# EAGLE design EngineLightControl_v1.1 (EAGLE 9.6.0)
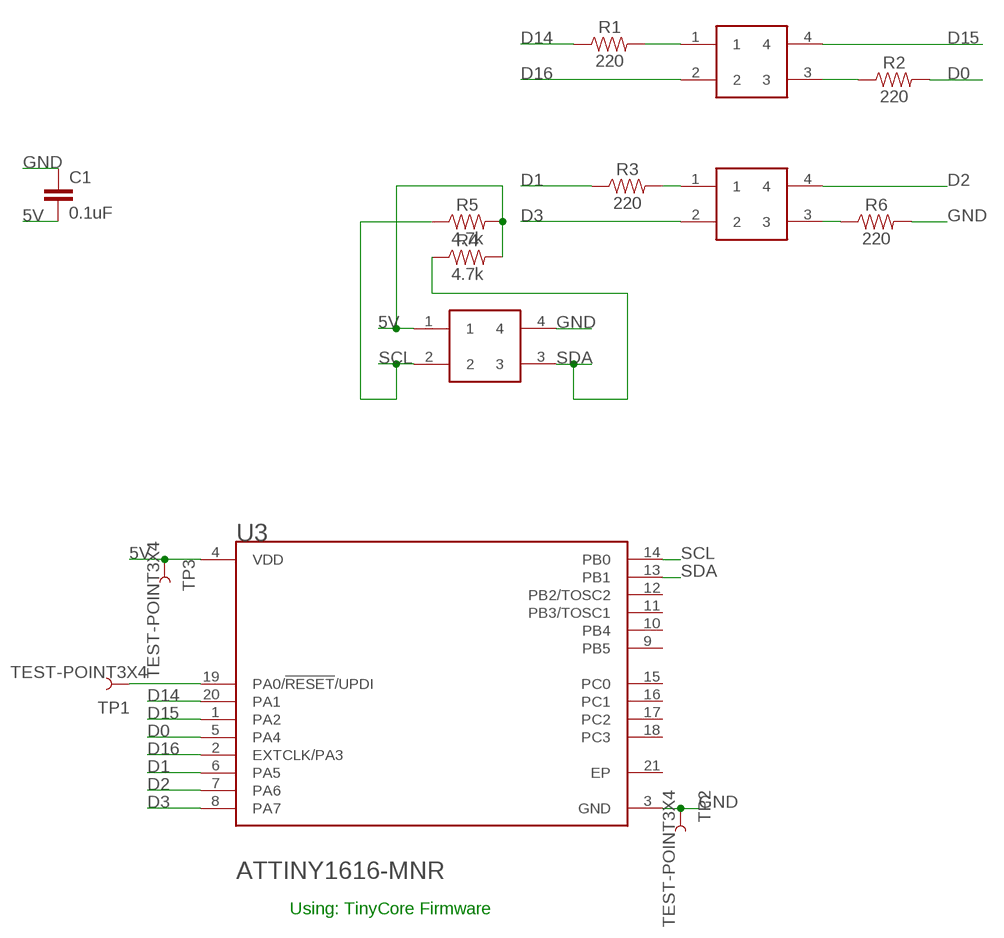
[diagram p0: schematic, sheet 1]

## Parts
C1  0.1uF  0.1UF-0603-25V-(+80/-20%)  [0603]
R1  220  220OHM-0603-1/10W-1%  [0603]
R2  220  220OHM-0603-1/10W-1%  [0603]
R3  220  220OHM-0603-1/10W-1%  [0603]
R4  4.7k  4.7KOHM-0603-1/10W-1%  [0603]
R5  4.7k  4.7KOHM-0603-1/10W-1%  [0603]
R6  220  220OHM-0603-1/10W-1%  [0603]
TP1  TEST-POINT3X4  [PAD.03X.04]
TP2  TEST-POINT3X4  [PAD.03X.04]
TP3  TEST-POINT3X4  [PAD.03X.04]
U3  MICROCHIP_ATTINY1616-MNRMICROCHIP_ATTINY1616-MNR_0_0  [MICROCHIP_ATTINY1616-MNR_0]
U$1  CONN_M04  [CONN_04]
U$2  CONN_M04  [CONN_04]
U$3  CONN_M04  [CONN_04]

## Nets
5V: C1.2 R4.2 R5.2 TP3.P$1 U3.4(VDD) U$1.1
D0: R2.2 U3.5(PA4)
D0_OUT: R2.1 U$2.3
D1: R3.1 U3.6(PA5)
D1_OUT: R3.2 U$3.1
D2: U3.7(PA6) U$3.4
D2_KATH: R6.1 U$3.3
D3: U3.8(PA7) U$3.2
D14: R1.1 U3.20(PA1)
D14_OUT: R1.2 U$2.1
D15: U3.1(PA2) U$2.4
D16: U3.2(EXTCLK/PA3) U$2.2
GND: C1.1 R6.2 TP2.P$1 U3.3(GND) U$1.4
SCL: R5.1 U3.14(PB0) U$1.2
SDA: R4.1 U3.13(PB1) U$1.3
UPDI: TP1.P$1 U3.19(PA0/!RESET!/UPDI)
Unconnected: U3.9(PB5) U3.10(PB4) U3.11(PB3/TOSC1) U3.12(PB2/TOSC2) U3.15(PC0) U3.16(PC1) U3.17(PC2) U3.18(PC3)

## Notes on the sheet
- Using: TinyCore Firmware

## Power pins joined to a net without a drawn wire
EP: U3.21(EP)

## Library data of the parts
C1 = SparkFun-Capacitors:0.1UF: 0.1µF ceramic capacitors A capacitor is a passive two-terminal electrical component used to store electrical energy temporarily in an electric field.; PROD_ID: CAP-00810
R1-R3 R6 = SparkFun-Resistors:220OHM: 220Ω resistor A resistor is a passive two-terminal electrical component that implements electrical resistance as a circuit element. Resistors act to reduce current flow, and, at the same time, act to lower voltage levels within circuits. - Wikipedia; PROD_ID: RES-07861
R4 R5 = SparkFun-Resistors:4.7KOHM: 4.7kΩ resistor A resistor is a passive two-terminal electrical component that implements electrical resistance as a circuit element. Resistors act to reduce current flow, and, at the same time, act to lower voltage levels within circuits. - Wikipedia; PROD_ID: RES-07857
TP1-TP3 = SparkFun-Connectors:TEST-POINT: SparkFun Test Points Bare copper test points for troubleshooting or In-Circuit-Testing. These are used by our Production team for verifying production board runs using pogo-pins on test beds. SparkFun Products: SparkFun LSM9DS1 Breakout <https://www.sparkfun.com/products/13284> SparkFun PSOC <https://www.sparkfun.com/products/13714> SparkFun Load Cell Amplifier <https://www.sparkfun.com/products/13879>
U3 = Microchip - ATTINY1616-MNR:MICROCHIP_ATTINY1616-MNR: AVR tinyAVR™ 1 Microcontroller IC 8-Bit 20MHz 16KB (16K x 8) FLASH 20-VQFN (3x3); AUTOMOTIVE: No; CENTROID_NOT_SPECIFIED: No; CORE_ARCHITECTURE: AVR; DATASHEET: http://ww1.microchip.com/downloads/en/DeviceDoc/ATtiny1616-3216-DataSheet-DS40001997C.pdf; DATA_BUS_WIDTH: 8bits; DEVICE_CLASS_L1: Integrated Circuits (ICs); DEVICE_CLASS_L2: Embedded Processors and Controllers; DEVICE_CLASS_L3: Microcontrollers; DIGIKEY_DESCRIPTION: IC MCU 8BIT 16KB FLASH 20VQFN; DIGIKEY_PART_NUMBER: ATTINY1616-MNRCT-ND; FOOTPRINT_PARAMETERS_1: {"fp_type":"QFN","params":{"N1":{"nom":5,"long name":"Leads on long side","min":null,"max":null,"short name":"N1","type":"count"},"N2":{"nom":5,"long name":"Leads on wide side","min":null,"max":null,"short name":"N2","type":"count"},"A":{"nom":850000,"long name":"Height","min":800000,"max":900000,"short name":"A","type":"measurement"},"A1":{"nom":35000,"long name":"Package clearance","min":0,"max":50000,"short name":"A1","type":"measurement"},"A2":{"nom":false,"long name":"Package height","min":750000,"max":900000,"short name":"A2","type":"measurement"},"D":{"nom":3000000,"long name":"Package length","min":2900000,"max":3100000,"short name":"D","type":"measurement"},"E":{"nom":3000000,"long name":"Package width","min":2900000,"max":3100000,"short name":"E","type":"measurement"},"B":{"nom":200000,"long name":"Lead width","min":150000,"max":250000,"short name":"B","type":"measurement"},"C":{"nom":203000,"long name":"Lead thickness","min":null,"max":null,"short name":"C","type":"measurement"},"L":{"nom":400000,"long name":"Lead foot length","min":350000,"max":450000,"short name":"L","type":"measurement"},"e":{"nom":400000,"long name":"Lead pitch","min":null,"max":null,"short name":"e","type":"measurement"},"HT":{"default":"Yes","long name":"Thermal pad","type":"multichoiceparent","short name":"HT","children":["D2","E2","PC"]},"offset x":{"nom":0,"long name":"X Center offset","min":null,"max":null,"short name":"offset x","type":"measurement"},"offset y":{"nom":0,"long name":"Y Center offset","min":null,"max":null,"short name":"offset y","type":"measurement"},"LS":{"default":"Rounded rectangle","long name":"Land shape","type":"multichoice","short name":"LS"},"LS1":{"default":"Rectangle","long name":"Land shape (Pin 1)","type":"multichoice","short name":"LS1"},"solder toe":{"nom":400000,"long name":"Solder fillet (toe)","min":null,"max":null,"short name":"solder toe","type":"fixedmeasurement"},"solder heel":{"nom":0,"long name":"Solder fillet (heel)","min":null,"max":null,"short name":"solder heel","type":"fixedmeasurement"},"solder side":{"nom":-40000,"long name":"Solder fillet (side)","min":null,"max":null,"short name":"solder side","type":"fixedmeasurement"},"courtyard":{"nom":500000,"long name":"Courtyard","min":null,"max":null,"short name":"courtyard","type":"fixedmeasurement"},"SF":{"default":"A","long name":"Packing level","type":"multichoiceparent","short name":"SF","help":"http://support.upverter.com/customer/portal/articles/978783-what-is-a-footprint-packing-level","children":["solder toe","solder heel","solder side","courtyard"]},"D2":{"nom":1700000,"long name":"Thermal pad length","min":1600000,"max":1800000,"short name":"D2","type":"measurement"},"E2":{"nom":1700000,"long name":"Thermal pad width","min":1600000,"max":1800000,"short name":"E2","type":"measurement"},"PC":{"long name":"Paste coverage (%)","type":"percentage","short name":"PC","value":40}}}; FOOTPRINT_PARAMETERS_2: {"fp_type":"QFN","params":{"N1":{"nom":5,"long name":"Leads on long side","min":null,"max":null,"short name":"N1","type":"count"},"N2":{"nom":5,"long name":"Leads on wide side","min":null,"max":null,"short name":"N2","type":"count"},"A":{"nom":850000,"long name":"Height","min":800000,"max":900000,"short name":"A","type":"measurement"},"A1":{"nom":35000,"long name":"Package clearance","min":0,"max":50000,"short name":"A1","type":"measurement"},"A2":{"nom":false,"long name":"Package height","min":750000,"max":900000,"short name":"A2","type":"measurement"},"D":{"nom":3000000,"long name":"Package length","min":2900000,"max":3100000,"short name":"D","type":"measurement"},"E":{"nom":3000000,"long name":"Package width","min":2900000,"max":3100000,"short name":"E","type":"measurement"},"B":{"nom":200000,"long name":"Lead width","min":150000,"max":250000,"short name":"B","type":"measurement"},"C":{"nom":203000,"long name":"Lead thickness","min":null,"max":null,"short name":"C","type":"measurement"},"L":{"nom":400000,"long name":"Lead foot length","min":350000,"max":450000,"short name":"L","type":"measurement"},"e":{"nom":400000,"long name":"Lead pitch","min":null,"max":null,"short name":"e","type":"measurement"},"D2":{"nom":1700000,"long name":"Thermal pad length","min":1600000,"max":1800000,"short name":"D2","type":"measurement"},"E2":{"nom":1700000,"long name":"Thermal pad width","min":1600000,"max":1800000,"short name":"E2","type":"measurement"},"PC":{"long name":"Paste coverage (%)","type":"percentage","short name":"PC","value":40},"HT":{"default":"Yes","long name":"Thermal pad","type":"multichoiceparent","short name":"HT","children":["D2","E2","PC"]},"offset x":{"nom":0,"long name":"X Center offset","min":null,"max":null,"short name":"offset x","type":"measurement"},"offset y":{"nom":0,"long name":"Y Center offset","min":null,"max":null,"short name":"offset y","type":"measurement"},"LS":{"default":"Rounded rectangle","long name":"Land shape","type":"multichoice","short name":"LS"},"LS1":{"default":"Rectangle","long name":"Land shape (Pin 1)","type":"multichoice","short name":"LS1"},"solder toe":{"nom":300000,"long name":"Solder fillet (toe)","min":null,"max":null,"short name":"solder toe","type":"fixedmeasurement"},"solder heel":{"nom":0,"long name":"Solder fillet (heel)","min":null,"max":null,"short name":"solder heel","type":"fixedmeasurement"},"solder side":{"nom":-40000,"long name":"Solder fillet (side)","min":null,"max":null,"short name":"solder side","type":"fixedmeasurement"},"courtyard":{"nom":250000,"long name":"Courtyard","min":null,"max":null,"short name":"courtyard","type":"fixedmeasurement"},"SF":{"default":"B","long name":"Packing level","type":"multichoiceparent","short name":"SF","help":"http://support.upverter.com/customer/portal/articles/978783-what-is-a-footprint-packing-level","children":["solder toe","solder heel","solder side","courtyard"]}}}; FOOTPRINT_PARAMETERS_3: {"fp_type":"QFN","params":{"N1":{"nom":5,"long name":"Leads on long side","min":null,"max":null,"short name":"N1","type":"count"},"N2":{"nom":5,"long name":"Leads on wide side","min":null,"max":null,"short name":"N2","type":"count"},"A":{"nom":850000,"long name":"Height","min":800000,"max":900000,"short name":"A","type":"measurement"},"A1":{"nom":35000,"long name":"Package clearance","min":0,"max":50000,"short name":"A1","type":"measurement"},"A2":{"nom":false,"long name":"Package height","min":750000,"max":900000,"short name":"A2","type":"measurement"},"D":{"nom":3000000,"long name":"Package length","min":2900000,"max":3100000,"short name":"D","type":"measurement"},"E":{"nom":3000000,"long name":"Package width","min":2900000,"max":3100000,"short name":"E","type":"measurement"},"B":{"nom":200000,"long name":"Lead width","min":150000,"max":250000,"short name":"B","type":"measurement"},"C":{"nom":203000,"long name":"Lead thickness","min":null,"max":null,"short name":"C","type":"measurement"},"L":{"nom":400000,"long name":"Lead foot length","min":350000,"max":450000,"short name":"L","type":"measurement"},"e":{"nom":400000,"long name":"Lead pitch","min":null,"max":null,"short name":"e","type":"measurement"},"D2":{"nom":1700000,"long name":"Thermal pad length","min":1600000,"max":1800000,"short name":"D2","type":"measurement"},"E2":{"nom":1700000,"long name":"Thermal pad width","min":1600000,"max":1800000,"short name":"E2","type":"measurement"},"PC":{"long name":"Paste coverage (%)","type":"percentage","short name":"PC","value":40},"HT":{"default":"Yes","long name":"Thermal pad","type":"multichoiceparent","short name":"HT","children":["D2","E2","PC"]},"offset x":{"nom":0,"long name":"X Center offset","min":null,"max":null,"short name":"offset x","type":"measurement"},"offset y":{"nom":0,"long name":"Y Center offset","min":null,"max":null,"short name":"offset y","type":"measurement"},"LS":{"default":"Rounded rectangle","long name":"Land shape","type":"multichoice","short name":"LS"},"LS1":{"default":"Rectangle","long name":"Land shape (Pin 1)","type":"multichoice","short name":"LS1"},"solder toe":{"nom":200000,"long name":"Solder fillet (toe)","min":null,"max":null,"short name":"solder toe","type":"fixedmeasurement"},"solder heel":{"nom":0,"long name":"Solder fillet (heel)","min":null,"max":null,"short name":"solder heel","type":"fixedmeasurement"},"solder side":{"nom":-40000,"long name":"Solder fillet (side)","min":null,"max":null,"short name":"solder side","type":"fixedmeasurement"},"courtyard":{"nom":100000,"long name":"Courtyard","min":null,"max":null,"short name":"courtyard","type":"fixedmeasurement"},"SF":{"default":"C","long name":"Packing level","type":"multichoiceparent","short name":"SF","help":"http://support.upverter.com/customer/portal/articles/978783-what-is-a-footprint-packing-level","children":["solder toe","solder heel","solder side","courtyard"]}}}; FOOTPRINT_VARIANT_NAME_0: Recommended_Land_Pattern; FOOTPRINT_VARIANT_NAME_1: IPC_A; FOOTPRINT_VARIANT_NAME_2: IPC_B; FOOTPRINT_VARIANT_NAME_3: IPC_C; FREQUENCY: 20MHz; HEIGHT: 0.9mm; INTERFACE: I2C,SPI,UART,USART,2-Wire,LIN,IrDA,RS-485; IPC_LAND_PATTERN_NAME: QFN40P300X300X85-20; LEAD_FREE: Yes; MAX_SUPPLY_VOLTAGE: 5.5V; MEMORY_SIZE: 16KBytes; MEMORY_TYPE: FLASH; MF: Microchip; MFG_PACKAGE_IDENT: C04-21380; MFG_PACKAGE_IDENT_COMPONENT_ID: caf5ea648aae8d21; MFG_PACKAGE_IDENT_DATE: 0; MFG_PACKAGE_IDENT_REV: A; MIN_SUPPLY_VOLTAGE: 1.8V; MOUSER_DESCRIPTION: MCU 8-bit AVR RISC 16KB Flash 2.5V/3.3V/5V 20-Pin VQFN EP T/R; MOUSER_PART_NUMBER: 556-ATTINY1616MNR; MPN: ATTINY1616-MNR; NOMINAL_SUPPLY_CURRENT: 5-10200uA; NUMBER_OF_A/D_CONVERTERS: 2; NUMBER_OF_ADC_CHANNELS: 20; NUMBER_OF_CORES: 1; NUMBER_OF_I/OS: 18; NUMBER_OF_I2C_CHANNELS: 1; NUMBER_OF_SPI_CHANNELS: 1; NUMBER_OF_TIMERS/COUNTERS: 3; NUMBER_OF_UART_CHANNELS: 1; PACKAGE: VQFN20; PREFIX: U; RAM_SIZE: 2KBytes; ROHS: Yes; STANDOFF_HEIGHT: 0mm; TEMPERATURE_RANGE_HIGH: +105°C; TEMPERATURE_RANGE_LOW: -40°C; VERIFICATION_VERSION: 0.0.0.3
U$1-U$3 = jk_customs:CONN_M04

## Net classes
0 Default: width 0.203 mm

## Board
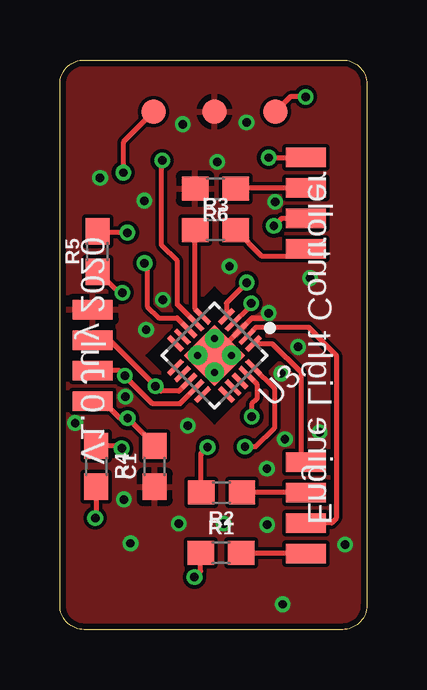
[diagram p1: board, top side]
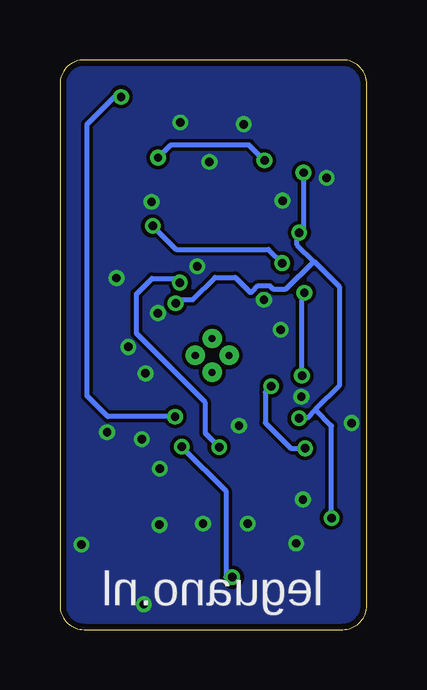
[diagram p2: board, bottom side, seen from below]

Size 12.8 x 23.75 mm. Coordinates in mm from the lower left corner, seen from the top.
Outline: 12.8,22.75 12.8,1 arc-90 11.8,0 1,0 arc-90 0,1 0,22.75 arc-90 1,23.75 11.8,23.75 arc-90 12.8,22.75
Copper layers (1*16): Top 0.035mm / dielectric 1.5mm / Bottom 0.035mm
Design rules "SeeedStudio_2layer_DRU_no_angle_20140221": minimum track width 6mil, minimum drill 12mil, track to track 6mil, track to pad 6mil, pad to pad 6mil, via to via 6mil, smd to smd 0mil, copper to edge 10mil, drill to drill 10mil, minimum pad ring 10mil, minimum via ring 6mil, stop-mask expansion 2mil, vias tented up to drill 100mil, thermal gap 10mil

### Footprints (pad centres in the part's own frame; a part is rotated, then mirrored left to right if it is on the bottom)
0603 = smd 1.1 x 1: 1 -0.85,0; 2 0.85,0
PAD.03X.04 = smd 1.016 x 1.016: P$1 0,0
MICROCHIP_ATTINY1616-MNR_0 = smd 0.8 x 0.2: 1 -1.5,0.8; 2 -1.5,0.4; 3 -1.5,0; 4 -1.5,-0.4; 5 -1.5,-0.8; 11 1.5,-0.8; 12 1.5,-0.4; 13 1.5,0; 14 1.5,0.4; 15 1.5,0.8 | smd 0.2 x 0.8: 6 -0.8,-1.5; 7 -0.4,-1.5; 8 0,-1.5; 9 0.4,-1.5; 10 0.8,-1.5; 16 0.8,1.5; 17 0.4,1.5; 18 0,1.5; 19 -0.4,1.5; 20 -0.8,1.5 | smd 1.8 x 1.8: 21 0,0 | drill 0.3 pad 0.6: PAD_1 -0.5,0.5; PAD_2 0.5,0.5; PAD_3 -0.5,-0.5; PAD_4 0.5,-0.5
CONN_04 = smd 0.813 x 1.676: 1 -1.905,0; 2 -0.635,0; 3 0.635,0; 4 1.905,0

### Placement (x,y rotation side)
C1  3.95,6.8 90 top
R1  6.72,3.2 0 top
R2  6.74,5.71 180 top
R3  6.49,16.65 0 top
R4  1.51,6.81 270 top
R5  1.57,15.76 90 top
R6  6.49,18.39 180 top
TP1  8.99,21.59 0 top
TP2  6.45,21.59 0 top
TP3  3.91,21.59 0 top
U3  6.45,11.43 225 top
U$1  1.37,11.43 90 top
U$2  10.26,5.08 90 top
U$3  10.26,17.78 90 top

### Tracks (layer width: path | path; a pad name or v marks a point on that pad's centre or on a via)
5V  (via drill 0.35)
  Top 0.203: U3.4 7.9,13.44 7.9,13.53 v7.97,13.6 | v2.82,16.55 1.64,16.55 R5.2 | 3.95,7.62 C1.2 3.95,7.69 2.91,8.74 2.89,8.74 v2.82,8.81 2.51,8.81 1.79,9.53 U$1.1 | TP3.P$1 2.64,20.32 v2.64,19.05 | R4.2 1.51,4.65 v1.47,4.65
  Bottom 0.203: v7.97,13.6 7.82,13.75 7.26,13.75 6.34,14.68 5.48,14.68 4.88,14.07 4.8,14.07 4.53,14.34 4.05,14.34 3.91,14.2 3.36,14.2 2.22,15.35 | 2.22,15.35 2.91,16.04 2.91,16.46 v2.82,16.55 2.64,16.73 v2.64,19.05 | v2.82,8.81 2.51,8.81 2.15,9.17 | 2.15,9.17 1.15,10.16 1.15,14.3 2.21,15.35 2.22,15.35 | v1.47,4.65 1.47,8.5 2.15,9.17
D0  (via drill 0.35)
  Top 0.203: R2.2 5.89,7.29 5.87,7.32 v6.16,7.61 | v7.8,14.46 6.94,13.61 U3.5
  Bottom 0.203: v6.16,7.61 6.73,8.18 6.73,9.46 9.61,12.34 9.61,13.99 8.96,14.64 7.97,14.64 v7.8,14.46
D0_OUT
  Top 0.203: U$2.3 R2.1
D1
  Top 0.203: U3.6 5.64,13.37 R3.1
D1_OUT
  Top 0.203: U$3.1 9.94,15.56 8.43,15.56 R3.2
D2  (via drill 0.35)
  Top 0.203: U3.7 4.9,13.54 4.9,15.35 4.24,16.02 4.24,19.53 v4.27,19.56 | v8.7,19.68 10.25,19.68 U$3.4
  Bottom 0.203: v4.27,19.56 4.91,20.21 8.18,20.21 v8.7,19.68
D2_KATH
  Top 0.203: U$3.3 7.36,18.41 R6.1
D3  (via drill 0.35)
  Top 0.203: v8.93,16.83 9.24,17.14 U$3.2 | v3.53,15.28 3.64,15.16 3.64,13.47 4.13,12.99 4.89,12.99 U3.8
  Bottom 0.203: v8.93,16.83 7.95,15.85 4.1,15.85 v3.53,15.28
D14  (via drill 0.35)
  Top 0.203: U3.20 8.94,10.07 8.94,8.39 8.16,7.62 v7.72,7.62 | v5.61,2.18 5.87,2.44 R1.1
  Bottom 0.203: v7.72,7.62 5.88,5.78 5.88,2.18 v5.61,2.18
D14_OUT
  Top 0.203: U$2.1 7.59,3.17 R1.2
D15
  Top 0.203: U3.1 8.85,11.93 10.04,10.73 10.04,7.2 U$2.4
D16
  Top 0.203: U3.2 8.2,12.61 10.37,12.61 10.68,12.31 10.68,12.28 11.53,11.43 11.53,4.64 11.34,4.45 U$2.2
GND  (via drill 0.35)
  Top 0.203: v8.71,13.2 8.51,12.99 8.01,12.99 U3.3 6.45,11.43
  other vias: 3.59,12.5 10.83,8.23 10.44,14.66 6.56,19.49 1.67,18.83 2.94,3.59 9.29,1.05 8.63,6.71 5.33,8.5 8.65,4.37 2.73,9.7 3.52,17.88 7.07,15.15 7.78,21.15 5.13,21.07 11.9,3.54 2.67,5.42 4.96,4.42 6.83,4.42 9.23,10.68 9.94,11.79 4.29,13.75 0.63,8.61 8.98,17.83 9.38,7.94
  pour Top: 15.34,29.21 -2.44,29.21 -2.44,-1.27 15.34,-1.27
  pour Bottom: 14.07,29.21 -3.71,29.21 -3.71,-1.27 14.07,-1.27
SCL  (via drill 0.35)
  Top 0.203: U3.14 5.03,9.44 5.03,9.41 3.87,9.41 v2.7,10.58 2.49,10.79 U$1.2 | v2.6,14.05 2.44,14.05 R5.1
  Bottom 0.203: v2.7,10.58 2.7,13.95 v2.6,14.05
SDA  (via drill 0.35)
  Top 0.203: U3.13 4.96,9.94 4.21,9.94 4.2,9.93 v3.99,10.15 2.07,12.06 U$1.3 | v2.58,7.56 2.48,7.66 R4.1
  Bottom 0.203: v2.58,7.56 3.16,7.56 4.23,8.62 4.23,9.91 v3.99,10.15
UPDI  (via drill 0.35)
  Top 0.203: U3.19 8.21,10.23 8.21,9.61 8,9.4 v8,8.88 | v10.25,22.21 9.61,22.21 TP1.P$1
  Bottom 0.203: v8,8.88 10.81,8.88 11.67,9.74 11.67,21.07 10.53,22.21 v10.25,22.21